# Altium schematic sheet XC7A35TFTG256_power.SchDoc
size A4; DocumentNumber: 21; SheetNumber: 21; SheetTotal: 21; SheetName: FPGA Power Distribution
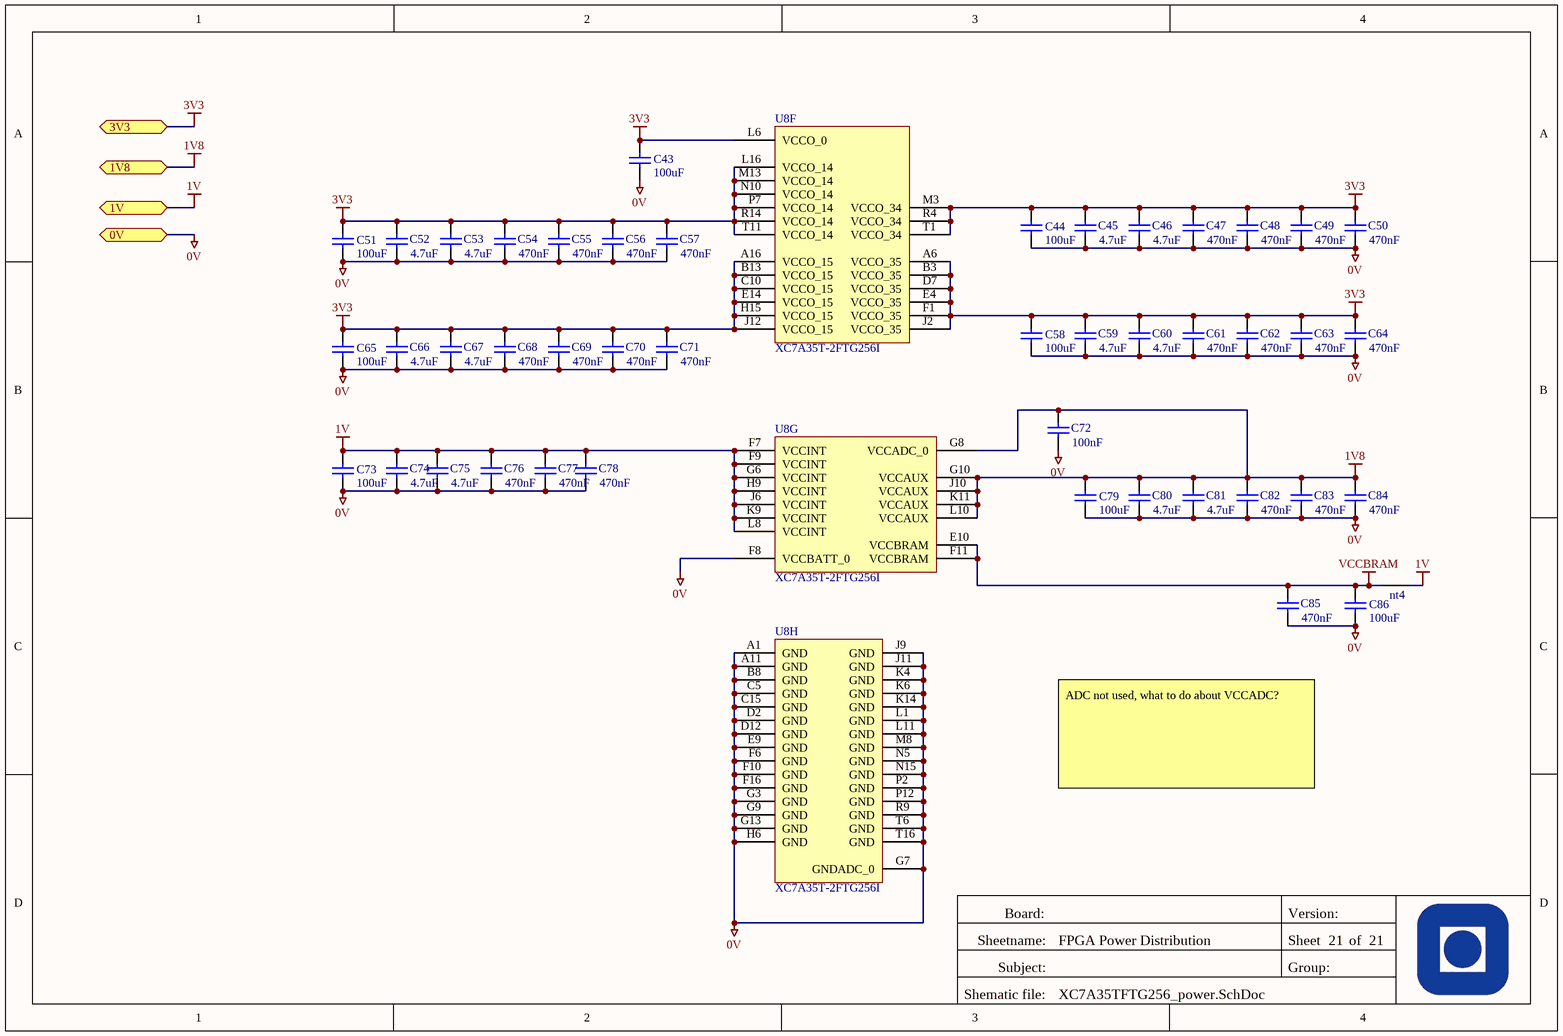
[diagram p0: XC7A35TFTG256_power.SchDoc]

## Parts
C43  value 100uF  [CAPC1210(3225)250_N]  (hidden comment: GRM32ER60J107ME20L)
C44  value 100uF  [CAPC1210(3225)250_N]  (hidden comment: GRM32ER60J107ME20L)
C45  value 4.7uF  [CAPC0603(1608)100_M]  (hidden comment: CAP 4.7uF 10V 0603(1608))
C46  value 4.7uF  [CAPC0603(1608)100_M]  (hidden comment: CAP 4.7uF 10V 0603(1608))
C47  value 470nF  [CAPC0603(1608)100_L]  (hidden comment: CAP 470nF 10V 0603(1608))
C48  value 470nF  [CAPC0603(1608)100_L]  (hidden comment: CAP 470nF 10V 0603(1608))
C49  value 470nF  [CAPC0603(1608)100_L]  (hidden comment: CAP 470nF 10V 0603(1608))
C50  value 470nF  [CAPC0603(1608)100_L]  (hidden comment: CAP 470nF 10V 0603(1608))
C51  value 100uF  [CAPC1210(3225)250_N]  (hidden comment: GRM32ER60J107ME20L)
C52  value 4.7uF  [CAPC0603(1608)100_M]  (hidden comment: CAP 4.7uF 10V 0603(1608))
C53  value 4.7uF  [CAPC0603(1608)100_M]  (hidden comment: CAP 4.7uF 10V 0603(1608))
C54  value 470nF  [CAPC0603(1608)100_L]  (hidden comment: CAP 470nF 10V 0603(1608))
C55  value 470nF  [CAPC0603(1608)100_L]  (hidden comment: CAP 470nF 10V 0603(1608))
C56  value 470nF  [CAPC0603(1608)100_L]  (hidden comment: CAP 470nF 10V 0603(1608))
C57  value 470nF  [CAPC0603(1608)100_L]  (hidden comment: CAP 470nF 10V 0603(1608))
C58  value 100uF  [CAPC1210(3225)250_N]  (hidden comment: GRM32ER60J107ME20L)
C59  value 4.7uF  [CAPC0603(1608)100_M]  (hidden comment: CAP 4.7uF 10V 0603(1608))
C60  value 4.7uF  [CAPC0603(1608)100_M]  (hidden comment: CAP 4.7uF 10V 0603(1608))
C61  value 470nF  [CAPC0603(1608)100_L]  (hidden comment: CAP 470nF 10V 0603(1608))
C62  value 470nF  [CAPC0603(1608)100_L]  (hidden comment: CAP 470nF 10V 0603(1608))
C63  value 470nF  [CAPC0603(1608)100_L]  (hidden comment: CAP 470nF 10V 0603(1608))
C64  value 470nF  [CAPC0603(1608)100_L]  (hidden comment: CAP 470nF 10V 0603(1608))
C65  value 100uF  [CAPC1210(3225)250_N]  (hidden comment: GRM32ER60J107ME20L)
C66  value 4.7uF  [CAPC0603(1608)100_M]  (hidden comment: CAP 4.7uF 10V 0603(1608))
C67  value 4.7uF  [CAPC0603(1608)100_M]  (hidden comment: CAP 4.7uF 10V 0603(1608))
C68  value 470nF  [CAPC0603(1608)100_L]  (hidden comment: CAP 470nF 10V 0603(1608))
C69  value 470nF  [CAPC0603(1608)100_L]  (hidden comment: CAP 470nF 10V 0603(1608))
C70  value 470nF  [CAPC0603(1608)100_L]  (hidden comment: CAP 470nF 10V 0603(1608))
C71  value 470nF  [CAPC0603(1608)100_L]  (hidden comment: CAP 470nF 10V 0603(1608))
C72  value 100nF  [CAPC0603(1608)100_M]  (hidden comment: CAP 100nF 16V 0603(1608))
C73  value 100uF  [CAPC1210(3225)250_N]  (hidden comment: GRM32ER60J107ME20L)
C74  value 4.7uF  [CAPC0603(1608)100_M]  (hidden comment: CAP 4.7uF 10V 0603(1608))
C75  value 4.7uF  [CAPC0603(1608)100_M]  (hidden comment: CAP 4.7uF 10V 0603(1608))
C76  value 470nF  [CAPC0603(1608)100_L]  (hidden comment: CAP 470nF 10V 0603(1608))
C77  value 470nF  [CAPC0603(1608)100_L]  (hidden comment: CAP 470nF 10V 0603(1608))
C78  value 470nF  [CAPC0603(1608)100_L]  (hidden comment: CAP 470nF 10V 0603(1608))
C79  value 100uF  [CAPC1210(3225)250_N]  (hidden comment: GRM32ER60J107ME20L)
C80  value 4.7uF  [CAPC0603(1608)100_M]  (hidden comment: CAP 4.7uF 10V 0603(1608))
C81  value 4.7uF  [CAPC0603(1608)100_M]  (hidden comment: CAP 4.7uF 10V 0603(1608))
C82  value 470nF  [CAPC0603(1608)100_L]  (hidden comment: CAP 470nF 10V 0603(1608))
C83  value 470nF  [CAPC0603(1608)100_L]  (hidden comment: CAP 470nF 10V 0603(1608))
C84  value 470nF  [CAPC0603(1608)100_L]  (hidden comment: CAP 470nF 10V 0603(1608))
C85  value 470nF  [CAPC0603(1608)100_L]  (hidden comment: CAP 470nF 10V 0603(1608))
C86  value 100uF  [CAPC1210(3225)250_N]  (hidden comment: GRM32ER60J107ME20L)
nt4  net tie  [net tie]  (value not drawn)  (net tie, no BOM)
U8  XC7A35T-2FTG256I  [FTG256]  (parts F,G,H of 8)

## Ports
0V, 1V, 1V8, 3V3

## Nets
0V: C43.1 C44.1 C45.1 C46.1 C47.1 C48.1 C49.1 C50.1 C51.1 C52.1 C53.1 C54.1 C55.1 C56.1 C57.1 C58.1 C59.1 C60.1 C61.1 C62.1 C63.1 C64.1 C65.1 C66.1 C67.1 C68.1 C69.1 C70.1 C71.1 C72.1 C73.1 C74.1 C75.1 C76.1 C77.1 C78.1 C79.1 C80.1 C81.1 C82.1 C83.1 C84.1 C85.1 C86.1 U8.A1(GND) U8.A11(GND) U8.B8(GND) U8.C5(GND) U8.C15(GND) U8.D2(GND) U8.D12(GND) U8.E9(GND) U8.F6(GND) U8.F8(VCCBATT_0) U8.F10(GND) U8.F16(GND) U8.G3(GND) U8.G7(GNDADC_0) U8.G9(GND) U8.G13(GND) U8.H6(GND) U8.J9(GND) U8.J11(GND) U8.K4(GND) U8.K6(GND) U8.K14(GND) U8.L1(GND) U8.L11(GND) U8.M8(GND) U8.N5(GND) U8.N15(GND) U8.P2(GND) U8.P12(GND) U8.R9(GND) U8.T6(GND) U8.T16(GND) ; port 0V
1V: C73.2 C74.2 C75.2 C76.2 C77.2 C78.2 nt4.1 U8.F7(VCCINT) U8.F9(VCCINT) U8.G6(VCCINT) U8.H9(VCCINT) U8.J6(VCCINT) U8.K9(VCCINT) U8.L8(VCCINT) ; port 1V
1V8: C72.2 C79.2 C80.2 C81.2 C82.2 C83.2 C84.2 U8.G8(VCCADC_0) U8.G10(VCCAUX) U8.J10(VCCAUX) U8.K11(VCCAUX) U8.L10(VCCAUX) ; port 1V8
3V3: C43.2 C44.2 C45.2 C46.2 C47.2 C48.2 C49.2 C50.2 C51.2 C52.2 C53.2 C54.2 C55.2 C56.2 C57.2 C58.2 C59.2 C60.2 C61.2 C62.2 C63.2 C64.2 C65.2 C66.2 C67.2 C68.2 C69.2 C70.2 C71.2 U8.A6(VCCO_35) U8.A16(VCCO_15) U8.B3(VCCO_35) U8.B13(VCCO_15) U8.C10(VCCO_15) U8.D7(VCCO_35) U8.E4(VCCO_35) U8.E14(VCCO_15) U8.F1(VCCO_35) U8.H15(VCCO_15) U8.J2(VCCO_35) U8.J12(VCCO_15) U8.L6(VCCO_0) U8.L16(VCCO_14) U8.M3(VCCO_34) U8.M13(VCCO_14) U8.N10(VCCO_14) U8.P7(VCCO_14) U8.R4(VCCO_34) U8.R14(VCCO_14) U8.T1(VCCO_34) U8.T11(VCCO_14) ; port 3V3
VCCBRAM: C85.2 C86.2 nt4.0 U8.E10(VCCBRAM) U8.F11(VCCBRAM)

## Notes on the sheet
- ADC not used, what to do about VCCADC?
- Board:
- Version:
- Sheetname:
- Subject:
- Group:
- Sheet
- of
- Shematic file:

## Library data of the parts
C43 C44 C51 C58 C65 C73 C79 C86 = GRM32ER60J107ME20L: 1210 100uF capacitor for artix-7 power decoupling; Supplier 1: Digi-Key; Supplier Part Number 1: 490-3390-1-ND
C45 C46 C52 C53 C59 C60 C66 C67 C74 C75 C80 C81 = CMP-1035-02785-1: CAP 4.7uF 10V ±10% 0603 (1608 Metric) Thickness 1mm SMD; Tolerance: Â±10%; Case-EIA: 0603; Case-Metric: 1608; Max Thickness: 1 mm; Technology: SMT; Rated Voltage: 10 V
C47-C50 C54-C57 C61-C64 C68-C71 C76-C78 C82-C85 = CMP-1035-02695-1: CAP 470nF 10V ±5% 0603 (1608 Metric) Thickness 1mm SMD; Tolerance: Â±5%; Case-EIA: 0603; Case-Metric: 1608; Rated Voltage: 10 V; Max Thickness: 1 mm; Technology: SMT
C72 = CMP-1035-02583-1: CAP 100nF 16V ±5% 0603 (1608 Metric) Thickness 1mm SMD; Tolerance: Â±5%; Case-Metric: 1608; Case-EIA: 0603; Rated Voltage: 16 V; Max Thickness: 1 mm; Technology: SMT
nt4 = net tie: used to connect nets without transferring net name
U8 = CMP-0383-00025-1: Artix-7 FPGA, 170 User I/Os, 0 GTP, 256-Ball BGA, Speed Grade 2, Industrial Grade, Pb-Free; Manufacturer: Xilinx; Logic Cells: 33280; GTP: 0; CMTs: 5; Available User I/O: 170; Total Block RAM: 1800 Kb; Speed Grades: 2; ComponentLink3Description: Pinout; ComponentLink4Description: Package Specification; ComponentLink2URL: http://www.xilinx.com/support/documentation/data_sheets/ds180_7Series_Overview.pdf; DatasheetVersion: Rev. 1.15; PackageVersion: Rev. 1.11; ComponentLink3URL: http://www.xilinx.com/support/documentation/user_guides/ug475_7Series_Pkg_Pinout.pdf; ComponentLink1Description: Manufacturer URL; PackageReference: FTG-256; ComponentLink1URL: http://www.xilinx.com/; ComponentLink4URL: http://www.xilinx.com/support/documentation/user_guides/ug475_7Series_Pkg_Pinout.pdf; Mounting Technology: Surface Mount; Maximum Distributed RAM: 400 Kb; PackageDescription: 256-Ball Wire-Bond Fine-Pitch Thin BGA, Body 17 x 17 mm, Pitch 1 mm; ComponentLink2Description: Datasheet; Operating Temperature Range: Industrial; PartNumber: XC7A35T-2FTG256I; PartId: 1